# EAGLE design Headband_Board (EAGLE 6.1)
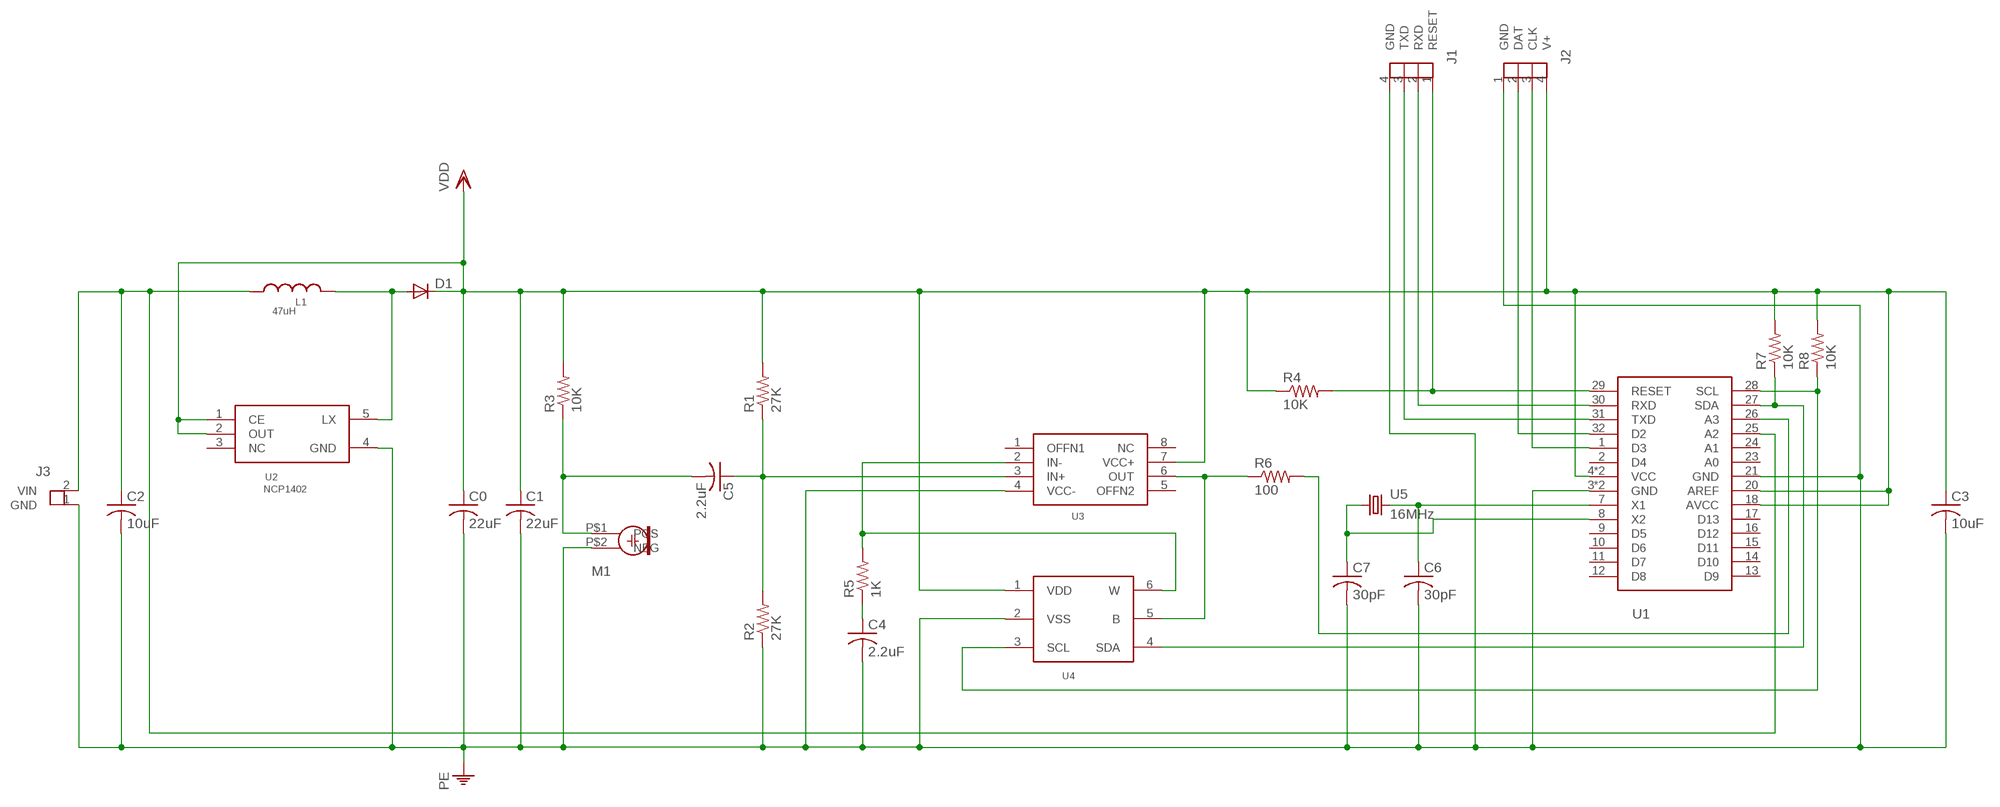
[diagram p0: schematic, sheet 1]

## Parts
C0  22uF  CAP0805  [0805]
C1  22uF  CAP0805  [0805]
C2  10uF  CAP0805  [0805]
C3  10uF  CAP0805  [0805]
C4  2.2uF  CAP0603  [0603]
C5  2.2uF  CAP0603  [0603]
C6  30pF  CAP0603  [0603]
C7  30pF  CAP0603  [0603]
D1  MBR0520LT  [SOD-123]
J1  PRGMCONN  [4CONN]
J2  LEDCONN  [4CONN]
J3  PWRCONN  [2CONN]
L1  47uH  CBC2518  [INDUCPAC]
M1  ELEC_MIC  [ELEC_MIC]
R1  27K  RESISTOR  [0603]
R2  27K  RESISTOR  [0603]
R3  10K  RESISTOR  [0603]
R4  10K  RESISTOR  [0603]
R5  1K  RESISTOR  [0603]
R6  100  RESISTOR  [0603]
R7  10K  RESISTOR  [0603]
R8  10K  RESISTOR  [0603]
U1  ATMEGA328P  [TQFP32-08]
U2  NCP1402  [TSOT-23-5]
U3  TL071  [8-SOIC]
U4  MCP4017  [SOT-363]
U5  16MHz  CRYSTAL  [HC49/US]

## Nets
J1: J1.1(RESET) R4.2 U1.29(RESET)
N$1: D1.A L1.2 U2.5(LX)
N$3: C5.2 M1.P$1(POS) R3.1
N$4: R7.1 U1.27(SDA) U4.4(SDA)
N$5: C5.1 R1.1 R2.2 U3.3(IN+)
N$6: R6.2 U1.26(A3)
N$7: C6.1 U1.7(X1) U5.P$2
N$8: C2.A J3.2(VIN) L1.3.7X1.2 U1.25(A2)
N$9: J1.2(RXD) U1.30(RXD)
N$10: C4.1 R5.1
N$11: R5.2 U3.2(IN-) U4.6(W)
N$12: J1.3(TXD) U1.31(TXD)
N$13: R6.1 U3.6(OUT) U4.5(B)
N$14: C7.1 U1.8(X2) U5.P$1
N$15: J2.2(DAT) U1.32(D2)
N$17: J2.3(CLK) U1.1(D3)
N$19: R8.1 U1.28(SCL) U4.3(SCL)
PE: C0.A1 C1.A1 C2.A1 C3.A1 C4.2 C6.2 C7.2 J1.4(GND) J2.1(GND) J3.1(GND) M1.P$2(NEG) R2.1 U1.3(GND) U1.5(GND) U1.21(GND) U2.4(GND) U3.4(VCC-) U4.2(VSS)
VDD: C0.A C1.A C3.A D1.B J2.4(V+) R1.2 R3.2 R4.1 R7.2 R8.2 U1.4(VCC) U1.6(VCC) U1.18(AVCC) U1.20(AREF) U2.1(CE) U2.2(OUT) U3.7(VCC+) U4.1(VDD)
Unconnected: U1.2(D4) U1.9(D5) U1.10(D6) U1.11(D7) U1.12(D8) U1.13(D9) U1.14(D10) U1.15(D11) U1.16(D12) U1.17(D13) U1.23(A0) U1.24(A1) U2.3(NC) U3.1(OFFN1) U3.5(OFFN2) U3.8(NC)

## Library data of the parts
C0 C1-C3 = lightsuits:CAP0805
C4-C7 = lightsuits:CAP0603
D1 = lightsuits:MBR0520LT
J1 = lightsuits:PRGMCONN
J2 = lightsuits:LEDCONN
J3 = lightsuits:PWRCONN
L1 = lightsuits:CBC2518
M1 = lightsuits:ELEC_MIC
R1-R8 = lightsuits:RESISTOR
U1 = lightsuits:ATMEGA328P
U2 = lightsuits:NCP1402
U3 = lightsuits:TL071
U4 = lightsuits:MCP4017
U5 = lightsuits:CRYSTAL

## Board
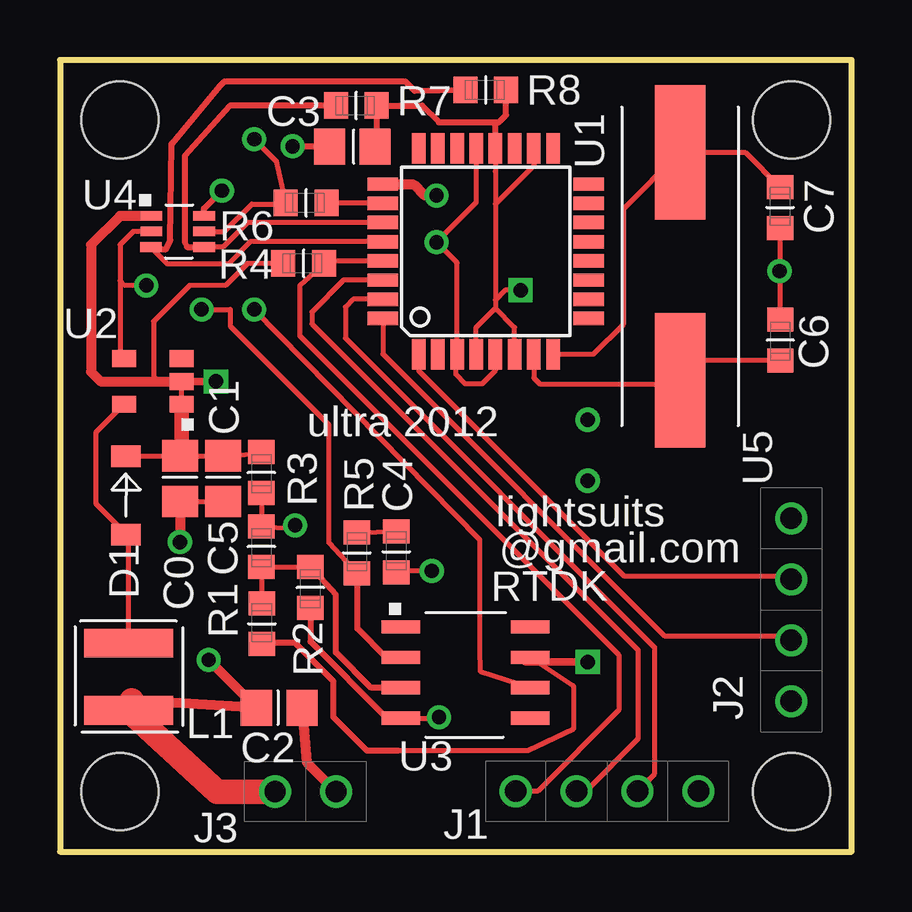
[diagram p1: board, top side]
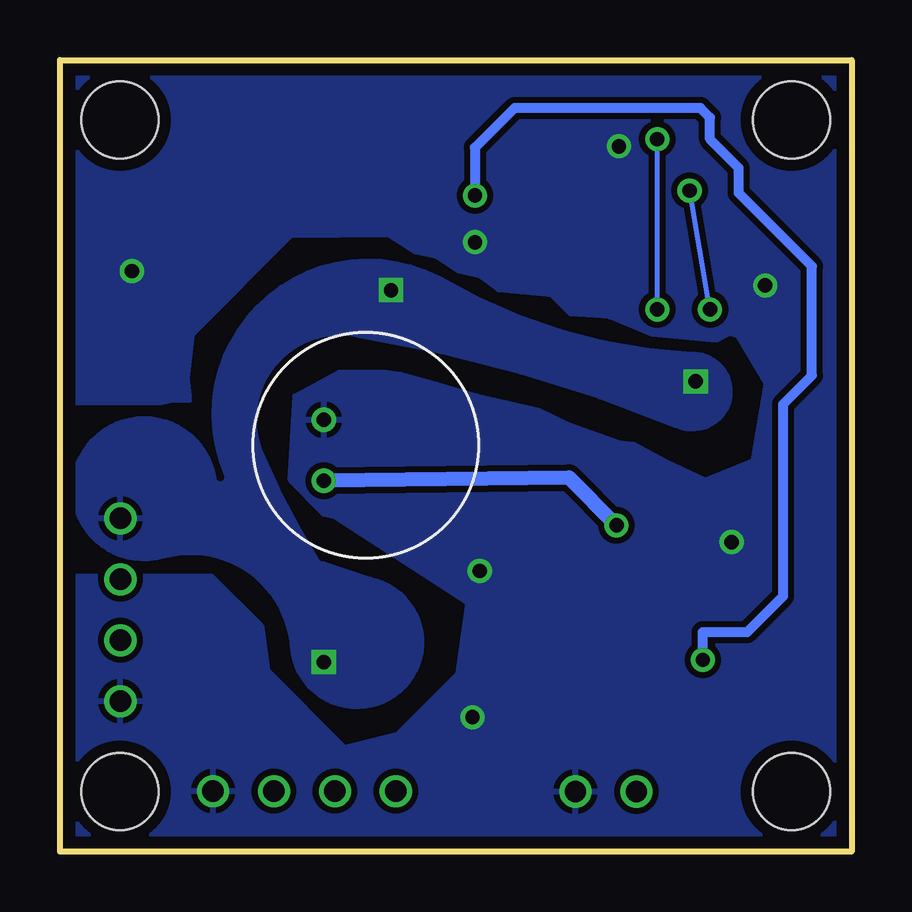
[diagram p2: board, bottom side, seen from below]

Size 33 x 33 mm. Coordinates in mm from the lower left corner, seen from the top.
Outline: 0,0 33,0 33,33 0,33 0,0
Copper layers (1*16): Top 0.0178mm / dielectric 59mil / Bottom 0.0178mm
Design rules: minimum track width 7mil, minimum drill 16mil, track to track 7mil, track to pad 7mil, pad to pad 7mil, via to via 7mil, smd to smd 7mil, copper to edge 20mil, drill to drill 16mil, minimum pad ring 8mil, minimum via ring 8mil, stop-mask expansion 3mil, vias tented up to drill 0mil, thermal gap 10mil
Holes 3.2 mm at 2.5,2.5 30.5,2.5 30.5,30.5 2.5,30.5

### Footprints (pad centres in the part's own frame; a part is rotated, then mirrored left to right if it is on the bottom)
0805 = smd 1.3 x 1.5: A 0,0; A1 1.9,0
0603 = smd 1 x 1.1: 1 -0.8,0; 2 0.9,0
SOD-123 = smd 0.91 x 1.22: A 0,0; B 3.27,0
4CONN = drill 0.89: 1 -3.81,0; 2 -1.27,0; 3 1.27,0; 4 3.81,0
2CONN = drill 0.89: 1 -3.81,0; 2 -1.27,0
INDUCPAC = smd 3.7 x 1.2: 2 0,0; 3.7X1.2 0,-2.8
ELEC_MIC = drill 0.6: P$1 0,2.54; P$2 0,0
TQFP32-08 = smd 1.27 x 0.559: 1 -4.293,2.8; 2 -4.293,2; 3 -4.293,1.2; 4 -4.293,0.4; 5 -4.293,-0.4; 6 -4.293,-1.2; 7 -4.293,-2; 8 -4.293,-2.8; 17 4.293,-2.8; 18 4.293,-2; 19 4.293,-1.2; 20 4.293,-0.4; 21 4.293,0.4; 22 4.293,1.2; 23 4.293,2; 24 4.293,2.8 | smd 0.559 x 1.27: 9 -2.8,-4.293; 10 -2,-4.293; 11 -1.2,-4.293; 12 -0.4,-4.293; 13 0.4,-4.293; 14 1.2,-4.293; 15 2,-4.293; 16 2.8,-4.293; 25 2.8,4.293; 26 2,4.293; 27 1.2,4.293; 28 0.4,4.293; 29 -0.4,4.293; 30 -1.2,4.293; 31 -2,4.293; 32 -2.8,4.293
TSOT-23-5 = smd 1 x 0.7: 1 0,0; 2 0,-0.95; 3 0,-1.9; 4 2.4,-1.9; 5 2.4,0
8-SOIC = smd 1.6 x 0.55: 1 0,0; 2 0,-1.27; 3 0,-2.54; 4 0,-3.81; 5 5.4,-3.81; 6 5.4,-2.54; 7 5.4,-1.27; 8 5.4,0
SOT-363 = smd 0.9 x 0.4: 1 0,0; 2 0,-0.65; 3 -0.02,-1.3; 4 2.2,-1.3; 5 2.2,-0.65; 6 2.2,0
HC49/US = smd 5.6 x 2.1: P$1 0,0; P$2 9.5,0

### Placement (x,y rotation side)
C0  5,16.5 270 top
C1  6.8,16.5 270 top
C2  8.19,6 0 top
C3  13.14,29.39 180 top
C4  14.02,12.54 270 top
C5  8.4,12.66 90 top
C6  30.03,21.27 90 top
C7  30.02,26.9 270 top
D1  2.75,13.21 90 top
J1  22.81,2.52 0 top
J2  30.48,10.08 90 top
J3  7.7,2.5 180 top
L1  2.87,8.69 0 top
M1  22,18 180 bottom
R1  8.42,9.55 270 top
R2  10.44,10.96 90 top
R3  8.4,15.75 90 top
R4  10.11,24.52 0 top
R5  12.38,12.5 270 top
R6  10.21,27.04 0 top
R7  12.3,31.1 0 top
R8  17.7,31.75 0 top
U1  17.75,25.02 90 top
U2  5.07,18.65 180 top
U3  14.21,9.37 0 top
U4  3.81,26.5 0 top
U5  25.85,29.15 270 top

### Tracks (layer width: path | path; a pad name or v marks a point on that pad's centre or on a via)
J1
  Top 0.203: U1.29 11.02,24.62 R4.2 10,23.61 10,21.5 23.3,8.2 23.3,5.9 19.92,2.52 J1.1
N$1
  Top 0.203: U2.5 1.5,17.48 1.5,14.5 2.75,13.25 D1.A 2.87,13.09 L1.2
N$3  (via drill 0.6)
  Top 0.203: R3.1 C5.2 9.66,13.46 v9.8,13.6
  Bottom 0.61: M1.P$1 11.79,15.59 v9.8,13.6
N$4
  Top 0.203: U1.27 7.82,26.22 6.8,25.2 U4.4
  Top 0.254: R7.1 7.1,31.1 5.2,29 5.2,25.4 5.3,25.2 U4.4
N$5
  Top 0.203: R1.1 8.4,10.37 C5.1 10.34,11.86 R2.2 10.74,11.76
  Top 0.254: U3.3 12.97,6.83 11.5,8.3 11.5,10.7 R2.2
N$6
  Top 0.203: U1.26 11.03,27.02 R6.2
N$7
  Top 0.203: U1.7 19.75,19.75 20,19.5 25.7,19.5 U5.P$2 26.67,20.47 C6.1
N$8  (via drill 0.6)
  Top 0.406: 2.98,6.3 C2.A v6.2,7.99 | v15.7,27.35 15.2,27.35 14.75,27.8 13.48,27.8 U1.25
  Top 1.016: J3.2 6.56,2.5 L1.3.7X1.2 2.98,6.3
  Bottom 0.406: v6.2,7.99 6.2,9.15 4.35,9.15 2.85,10.65 2.85,18.65 1.65,19.85 1.65,24.4 4.7,27.45 4.7,28.5 5.9,29.7 5.9,30.6 6.3,31 14.05,31 15.7,29.35 v15.7,27.35
N$9
  Top 0.203: U1.30 11.82,23.82 10.5,22.5 10.5,22 24.1,8.4 24.1,4.7 21.92,2.52 J1.2 21.5,2.56
N$10
  Top 0.203: R5.1 C4.1
N$11  (via drill 0.6)
  Top 0.203: v5.9,22.6 7.1,22.6 7.1,21.9 11.2,17.8 11.2,12.88 R5.2
  Top 0.254: U3.2 13.6,8.1 12.4,9.3 12.4,11.68 R5.2 | U4.6 6.01,26.81 v6.75,27.55
  Bottom 0.203: v5.9,22.6 v6.75,27.55
N$12
  Top 0.203: U1.31 12.22,23.02 11.9,22.7 11.9,21.4 24.8,8.5 24.8,3.24 J1.3
N$13  (via drill 0.6)
  Top 0.203: 5.65,25.85 U4.5 6.85,25.85 8,27 9.37,27 R6.1 9.01,28.79 v8.1,29.7 | U3.6 17.54,7.5 17.5,8.5 17.5,13 v8.1,22.6
  Bottom 0.203: v8.1,22.6 v8.1,29.7
N$14
  Top 0.203: U1.8 22.23,20.73 23.5,22 23.5,26.8 U5.P$1 28.57,29.15 C7.1
N$15
  Top 0.203: U1.32 13.46,20.74 25.2,9 30.29,9 J2.2
N$17
  Top 0.203: U1.1 14.95,20.05 23.5,11.5 30.33,11.5 J2.3
N$19
  Top 0.203: U1.28 7.92,25.42 7,24.5 4.49,24.5 U4.3
  Top 0.254: U4.3 4.4,25.1 4.6,25.5 4.65,29.5 6.65,31.9 6.85,32.1 14.4,32.1 14.8,31.7 R8.1
PE  (via drill 0.6)
  Top 0.203: U4.2 3.05,25.85 2.5,25.3 2.5,23.8 | 2.5,23.8 2.5,20.72 U2.4 | C0.A1 C1.A1 | U3.4 15.76,5.56 v15.8,5.6 | U1.21 17.35,27.05 v15.7,25.4 16.55,24.55 U1.3 16.5,20.68 16.5,19.9 16.9,19.5 17.6,19.5 18.15,20.05 U1.5 | v3.6,23.6 2.7,23.6 2.5,23.8 | v15.5,11.7 14.06,11.7 C4.2 | C7.2 30.02,24.22 v30,24.2 30.03,24.17 C6.2
  Top 0.254: R2.1 10.44,8.76 13.6,5.6 14.17,5.6 U3.4 | v9.7,29.4 C3.A1
  Top 0.406: C2.A1 10.29,3.72 J3.1 | C0.A1 v5,12.9
  pour Bottom (isolate 0.254): 33,18.3 33,33.1 28.4,33.1 28.4,33 0,33 0,0 33,0 33,11.5 26.7,11.5 24.6,9.4 24.35,7.55 21.15,4.35 18.9,4.9 16.4,7.4 16,10.35 21.55,13.95 22,14.05 23.4,15.5 23.2,19 21.35,20 19.45,20 18.8,19.9 17.3,19.5 15.6,19 13.05,18.4 11.8,17.8 9.7,17.05 9.1,17 7.7,16.25 6.1,15.5 4.1,16.3 3.55,19.5 4.75,21.5 5.1,21.6 5.65,21.3 8.3,21.55 10.1,22.3 11.7,22.4 12.5,23.2 14.7,23.4 15.5,24 16.4,24.2 17.3,24.8 18.2,25 19.3,25.7 23.4,25.65 27.5,21.55 27.7,19.75 27.6,18.8 28.3,18.8 28.8,18.7 32.4,18.7 32.9,18.2
VDD  (via drill 0.6)
  Top 0.203: U2.1 U2.2 | 5.07,16.67 C0.A | D1.B 4.88,16.48 C0.A | C0.A C1.A 8.35,16.6 R3.2 | 17.5,20.88 U1.4 17.35,21.85 18.15,22.65 | 18.15,27 U1.20 18.15,28.35 | 18.15,27 18.15,23 | 18.15,23 18.15,22.65 | U1.6 18.95,21.85 18.15,22.65 | U1.18 19.75,28.6 18.15,27 | U3.7 21.4,6.91 21.4,5.1 19.5,4.2 14.1,4.2 | R4.1 7.82,24.52 6.9,23.6 5.4,23.6 3.9,22.1 3.9,19.7 4,19.6 | v19.2,23.4 18.55,23.4 18.15,23
  Top 0.254: 14.1,4.2 12.8,4.2 11.4,5.6 11.4,7.1 9.8,8.7 8.47,8.7 R1.2 | 13.1,29.43 C3.A 13.2,29.45 R7.2 15.1,31.1 15.8,30.4 18.1,30.4 | 18.1,30.4 18.3,30.4 18.6,30.7 R8.2 | U1.20 18.15,30.35 18.1,30.4
  Top 0.305: v22,7.9 19.41,7.9 U3.7 | U2.2 v6.5,19.6
  Top 0.406: U4.1 2.5,26.5 1.3,25.3 1.3,20 1.7,19.6 4,19.6 U2.2
  Top 0.61: 5.07,16.67 U2.1
  pour Bottom: 22,12 20.05,11.35 arc253 23.3,8.5 arc-102 28.7,12.3 arc276 26.6,15.6 arc-195 26.05,15.7 arc141 17.2,23.9 arc-28 6.65,20.75 arc205 7.3,17.75 arc-13 20.5,21.5 arc-125 24.65,16.65 arc-8 22.25,12.05

### Text on the board
tPlace: ultra 2012 | lightsuits | @gmail.com | RTDK